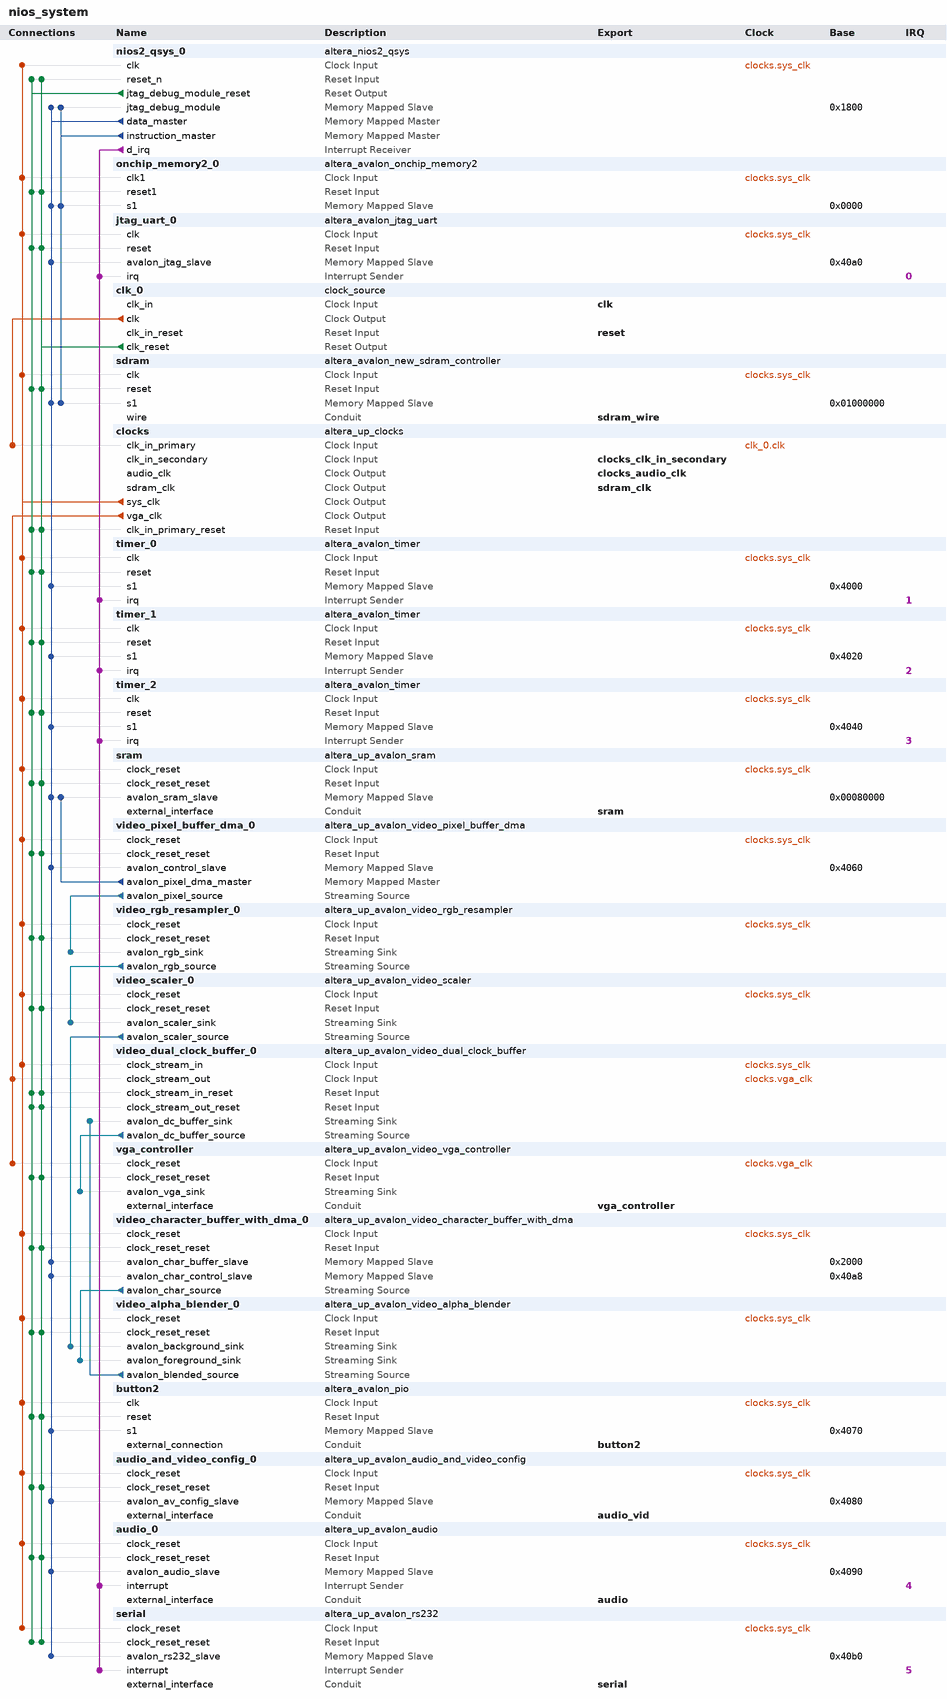
[diagram p0: system contents]
# Platform Designer (Qsys) system nios_system, Cyclone II EP2C35F672C6
# Parameters at their usual value, and those the tool derives, are not listed.
package require -exact qsys 12.0
create_system nios_system
set_project_property DEVICE_FAMILY {Cyclone II}
set_project_property DEVICE EP2C35F672C6

add_instance nios2_qsys_0 altera_nios2_qsys 12.0
set_instance_parameter_value nios2_qsys_0 resetSlave sdram.s1
set_instance_parameter_value nios2_qsys_0 exceptionSlave sdram.s1
set_instance_parameter_value nios2_qsys_0 breakSlave nios2_qsys_0.jtag_debug_module
set_instance_parameter_value nios2_qsys_0 impl Fast
set_instance_parameter_value nios2_qsys_0 icache_size 4096

add_instance onchip_memory2_0 altera_avalon_onchip_memory2 12.0
set_instance_parameter_value onchip_memory2_0 dataWidth 32
set_instance_parameter_value onchip_memory2_0 dualPort false
set_instance_parameter_value onchip_memory2_0 initMemContent true
set_instance_parameter_value onchip_memory2_0 initializationFileName onchip_memory2_0
set_instance_parameter_value onchip_memory2_0 memorySize 4096

add_instance jtag_uart_0 altera_avalon_jtag_uart 12.0
set_instance_parameter_value jtag_uart_0 simInteractiveOptions INTERACTIVE_ASCII_OUTPUT

add_instance clk_0 clock_source 12.0
set_instance_parameter_value clk_0 clockFrequency 50000000

add_instance sdram altera_avalon_new_sdram_controller 12.0
set_instance_parameter_value sdram TAC 5.5
set_instance_parameter_value sdram TRCD 20.0
set_instance_parameter_value sdram TRP 20.0
set_instance_parameter_value sdram casLatency 3
set_instance_parameter_value sdram columnWidth 8
set_instance_parameter_value sdram dataWidth 16
set_instance_parameter_value sdram generateSimulationModel false
set_instance_parameter_value sdram model custom
set_instance_parameter_value sdram numberOfBanks 4
set_instance_parameter_value sdram numberOfChipSelects 1
set_instance_parameter_value sdram powerUpDelay 100.0
set_instance_parameter_value sdram refreshPeriod 15.625
set_instance_parameter_value sdram rowWidth 12

add_instance clocks altera_up_clocks 12.0
set_instance_parameter_value clocks board DE2
set_instance_parameter_value clocks vga_clk true
set_instance_parameter_value clocks audio_clk true
set_instance_parameter_value clocks audio_clk_freq 12.288

add_instance timer_0 altera_avalon_timer 12.0
set_instance_parameter_value timer_0 period 1
set_instance_parameter_value timer_0 periodUnits MSEC
set_instance_parameter_value timer_0 timerPreset FULL_FEATURED

add_instance timer_1 altera_avalon_timer 12.0
set_instance_parameter_value timer_1 period 1
set_instance_parameter_value timer_1 periodUnits MSEC
set_instance_parameter_value timer_1 timerPreset CUSTOM

add_instance timer_2 altera_avalon_timer 12.0
set_instance_parameter_value timer_2 period 1
set_instance_parameter_value timer_2 periodUnits MSEC
set_instance_parameter_value timer_2 timerPreset CUSTOM

add_instance sram altera_up_avalon_sram 12.0
set_instance_parameter_value sram board DE2
set_instance_parameter_value sram pixel_buffer true

add_instance video_pixel_buffer_dma_0 altera_up_avalon_video_pixel_buffer_dma 12.0
set_instance_parameter_value video_pixel_buffer_dma_0 addr_mode X-Y
set_instance_parameter_value video_pixel_buffer_dma_0 start_address 0
set_instance_parameter_value video_pixel_buffer_dma_0 back_start_address 0
set_instance_parameter_value video_pixel_buffer_dma_0 image_width 320
set_instance_parameter_value video_pixel_buffer_dma_0 image_height 240
set_instance_parameter_value video_pixel_buffer_dma_0 color_space {16-bit RGB}

add_instance video_rgb_resampler_0 altera_up_avalon_video_rgb_resampler 12.0
set_instance_parameter_value video_rgb_resampler_0 input_type {16-bit RGB}
set_instance_parameter_value video_rgb_resampler_0 output_type {30-bit RGB}
set_instance_parameter_value video_rgb_resampler_0 alpha 1023

add_instance video_scaler_0 altera_up_avalon_video_scaler 12.0
set_instance_parameter_value video_scaler_0 width_scaling 2
set_instance_parameter_value video_scaler_0 height_scaling 2
set_instance_parameter_value video_scaler_0 width_in 320
set_instance_parameter_value video_scaler_0 color_bits 10
set_instance_parameter_value video_scaler_0 color_planes 3

add_instance video_dual_clock_buffer_0 altera_up_avalon_video_dual_clock_buffer 12.0
set_instance_parameter_value video_dual_clock_buffer_0 color_bits 10

add_instance vga_controller altera_up_avalon_video_vga_controller 12.0
set_instance_parameter_value vga_controller board DE2

add_instance video_character_buffer_with_dma_0 altera_up_avalon_video_character_buffer_with_dma 12.0
set_instance_parameter_value video_character_buffer_with_dma_0 enable_transparency true

add_instance video_alpha_blender_0 altera_up_avalon_video_alpha_blender 12.0

add_instance button2 altera_avalon_pio 12.0
set_instance_parameter_value button2 direction Input
set_instance_parameter_value button2 width 1

add_instance audio_and_video_config_0 altera_up_avalon_audio_and_video_config 12.0
set_instance_parameter_value audio_and_video_config_0 board DE2
set_instance_parameter_value audio_and_video_config_0 audio_in {Microphone to ADC}
set_instance_parameter_value audio_and_video_config_0 line_in_bypass false
set_instance_parameter_value audio_and_video_config_0 bit_length 16
set_instance_parameter_value audio_and_video_config_0 sampling_rate {32 kHz}

add_instance audio_0 altera_up_avalon_audio 12.0
set_instance_parameter_value audio_0 avalon_bus_type {Memory Mapped}
set_instance_parameter_value audio_0 audio_in true
set_instance_parameter_value audio_0 dw 16

add_instance serial altera_up_avalon_rs232 12.0
set_instance_parameter_value serial baud 115200
set_instance_parameter_value serial parity None

# connections
add_connection clk_0.clk clocks.clk_in_primary clock
add_connection clocks.sys_clk audio_0.clock_reset clock
add_connection clocks.sys_clk audio_and_video_config_0.clock_reset clock
add_connection clocks.sys_clk button2.clk clock
add_connection clocks.sys_clk jtag_uart_0.clk clock
add_connection clocks.sys_clk nios2_qsys_0.clk clock
add_connection clocks.sys_clk onchip_memory2_0.clk1 clock
add_connection clocks.sys_clk sdram.clk clock
add_connection clocks.sys_clk serial.clock_reset clock
add_connection clocks.sys_clk sram.clock_reset clock
add_connection clocks.sys_clk timer_0.clk clock
add_connection clocks.sys_clk timer_1.clk clock
add_connection clocks.sys_clk timer_2.clk clock
add_connection clocks.sys_clk video_alpha_blender_0.clock_reset clock
add_connection clocks.sys_clk video_character_buffer_with_dma_0.clock_reset clock
add_connection clocks.sys_clk video_dual_clock_buffer_0.clock_stream_in clock
add_connection clocks.sys_clk video_pixel_buffer_dma_0.clock_reset clock
add_connection clocks.sys_clk video_rgb_resampler_0.clock_reset clock
add_connection clocks.sys_clk video_scaler_0.clock_reset clock
add_connection clocks.vga_clk vga_controller.clock_reset clock
add_connection clocks.vga_clk video_dual_clock_buffer_0.clock_stream_out clock
add_connection clk_0.clk_reset audio_0.clock_reset_reset reset
add_connection clk_0.clk_reset audio_and_video_config_0.clock_reset_reset reset
add_connection clk_0.clk_reset button2.reset reset
add_connection clk_0.clk_reset clocks.clk_in_primary_reset reset
add_connection clk_0.clk_reset jtag_uart_0.reset reset
add_connection clk_0.clk_reset nios2_qsys_0.reset_n reset
add_connection clk_0.clk_reset onchip_memory2_0.reset1 reset
add_connection clk_0.clk_reset sdram.reset reset
add_connection clk_0.clk_reset serial.clock_reset_reset reset
add_connection clk_0.clk_reset sram.clock_reset_reset reset
add_connection clk_0.clk_reset timer_0.reset reset
add_connection clk_0.clk_reset timer_1.reset reset
add_connection clk_0.clk_reset timer_2.reset reset
add_connection clk_0.clk_reset vga_controller.clock_reset_reset reset
add_connection clk_0.clk_reset video_alpha_blender_0.clock_reset_reset reset
add_connection clk_0.clk_reset video_character_buffer_with_dma_0.clock_reset_reset reset
add_connection clk_0.clk_reset video_dual_clock_buffer_0.clock_stream_in_reset reset
add_connection clk_0.clk_reset video_dual_clock_buffer_0.clock_stream_out_reset reset
add_connection clk_0.clk_reset video_pixel_buffer_dma_0.clock_reset_reset reset
add_connection clk_0.clk_reset video_rgb_resampler_0.clock_reset_reset reset
add_connection clk_0.clk_reset video_scaler_0.clock_reset_reset reset
add_connection nios2_qsys_0.jtag_debug_module_reset audio_0.clock_reset_reset reset
add_connection nios2_qsys_0.jtag_debug_module_reset audio_and_video_config_0.clock_reset_reset reset
add_connection nios2_qsys_0.jtag_debug_module_reset button2.reset reset
add_connection nios2_qsys_0.jtag_debug_module_reset clocks.clk_in_primary_reset reset
add_connection nios2_qsys_0.jtag_debug_module_reset jtag_uart_0.reset reset
add_connection nios2_qsys_0.jtag_debug_module_reset nios2_qsys_0.reset_n reset
add_connection nios2_qsys_0.jtag_debug_module_reset onchip_memory2_0.reset1 reset
add_connection nios2_qsys_0.jtag_debug_module_reset sdram.reset reset
add_connection nios2_qsys_0.jtag_debug_module_reset serial.clock_reset_reset reset
add_connection nios2_qsys_0.jtag_debug_module_reset sram.clock_reset_reset reset
add_connection nios2_qsys_0.jtag_debug_module_reset timer_0.reset reset
add_connection nios2_qsys_0.jtag_debug_module_reset timer_1.reset reset
add_connection nios2_qsys_0.jtag_debug_module_reset timer_2.reset reset
add_connection nios2_qsys_0.jtag_debug_module_reset vga_controller.clock_reset_reset reset
add_connection nios2_qsys_0.jtag_debug_module_reset video_alpha_blender_0.clock_reset_reset reset
add_connection nios2_qsys_0.jtag_debug_module_reset video_character_buffer_with_dma_0.clock_reset_reset reset
add_connection nios2_qsys_0.jtag_debug_module_reset video_dual_clock_buffer_0.clock_stream_in_reset reset
add_connection nios2_qsys_0.jtag_debug_module_reset video_dual_clock_buffer_0.clock_stream_out_reset reset
add_connection nios2_qsys_0.jtag_debug_module_reset video_pixel_buffer_dma_0.clock_reset_reset reset
add_connection nios2_qsys_0.jtag_debug_module_reset video_rgb_resampler_0.clock_reset_reset reset
add_connection nios2_qsys_0.jtag_debug_module_reset video_scaler_0.clock_reset_reset reset
add_connection nios2_qsys_0.data_master audio_0.avalon_audio_slave avalon
set_connection_parameter_value nios2_qsys_0.data_master/audio_0.avalon_audio_slave baseAddress 0x4090
add_connection nios2_qsys_0.data_master audio_and_video_config_0.avalon_av_config_slave avalon
set_connection_parameter_value nios2_qsys_0.data_master/audio_and_video_config_0.avalon_av_config_slave baseAddress 0x4080
add_connection nios2_qsys_0.data_master button2.s1 avalon
set_connection_parameter_value nios2_qsys_0.data_master/button2.s1 baseAddress 0x4070
add_connection nios2_qsys_0.data_master jtag_uart_0.avalon_jtag_slave avalon
set_connection_parameter_value nios2_qsys_0.data_master/jtag_uart_0.avalon_jtag_slave baseAddress 0x40a0
add_connection nios2_qsys_0.data_master nios2_qsys_0.jtag_debug_module avalon
set_connection_parameter_value nios2_qsys_0.data_master/nios2_qsys_0.jtag_debug_module baseAddress 0x1800
add_connection nios2_qsys_0.data_master onchip_memory2_0.s1 avalon
set_connection_parameter_value nios2_qsys_0.data_master/onchip_memory2_0.s1 baseAddress 0x0000
add_connection nios2_qsys_0.data_master sdram.s1 avalon
set_connection_parameter_value nios2_qsys_0.data_master/sdram.s1 baseAddress 0x01000000
add_connection nios2_qsys_0.data_master serial.avalon_rs232_slave avalon
set_connection_parameter_value nios2_qsys_0.data_master/serial.avalon_rs232_slave baseAddress 0x40b0
add_connection nios2_qsys_0.data_master sram.avalon_sram_slave avalon
set_connection_parameter_value nios2_qsys_0.data_master/sram.avalon_sram_slave baseAddress 0x00080000
add_connection nios2_qsys_0.data_master timer_0.s1 avalon
set_connection_parameter_value nios2_qsys_0.data_master/timer_0.s1 baseAddress 0x4000
add_connection nios2_qsys_0.data_master timer_1.s1 avalon
set_connection_parameter_value nios2_qsys_0.data_master/timer_1.s1 baseAddress 0x4020
add_connection nios2_qsys_0.data_master timer_2.s1 avalon
set_connection_parameter_value nios2_qsys_0.data_master/timer_2.s1 baseAddress 0x4040
add_connection nios2_qsys_0.data_master video_character_buffer_with_dma_0.avalon_char_buffer_slave avalon
set_connection_parameter_value nios2_qsys_0.data_master/video_character_buffer_with_dma_0.avalon_char_buffer_slave baseAddress 0x2000
add_connection nios2_qsys_0.data_master video_character_buffer_with_dma_0.avalon_char_control_slave avalon
set_connection_parameter_value nios2_qsys_0.data_master/video_character_buffer_with_dma_0.avalon_char_control_slave baseAddress 0x40a8
add_connection nios2_qsys_0.data_master video_pixel_buffer_dma_0.avalon_control_slave avalon
set_connection_parameter_value nios2_qsys_0.data_master/video_pixel_buffer_dma_0.avalon_control_slave baseAddress 0x4060
add_connection nios2_qsys_0.instruction_master nios2_qsys_0.jtag_debug_module avalon
set_connection_parameter_value nios2_qsys_0.instruction_master/nios2_qsys_0.jtag_debug_module baseAddress 0x1800
add_connection nios2_qsys_0.instruction_master onchip_memory2_0.s1 avalon
set_connection_parameter_value nios2_qsys_0.instruction_master/onchip_memory2_0.s1 baseAddress 0x0000
add_connection nios2_qsys_0.instruction_master sdram.s1 avalon
set_connection_parameter_value nios2_qsys_0.instruction_master/sdram.s1 baseAddress 0x01000000
add_connection video_pixel_buffer_dma_0.avalon_pixel_dma_master sram.avalon_sram_slave avalon
set_connection_parameter_value video_pixel_buffer_dma_0.avalon_pixel_dma_master/sram.avalon_sram_slave baseAddress 0x00080000
add_connection video_alpha_blender_0.avalon_blended_source video_dual_clock_buffer_0.avalon_dc_buffer_sink avalon_streaming
add_connection video_character_buffer_with_dma_0.avalon_char_source video_alpha_blender_0.avalon_foreground_sink avalon_streaming
add_connection video_dual_clock_buffer_0.avalon_dc_buffer_source vga_controller.avalon_vga_sink avalon_streaming
add_connection video_pixel_buffer_dma_0.avalon_pixel_source video_rgb_resampler_0.avalon_rgb_sink avalon_streaming
add_connection video_rgb_resampler_0.avalon_rgb_source video_scaler_0.avalon_scaler_sink avalon_streaming
add_connection video_scaler_0.avalon_scaler_source video_alpha_blender_0.avalon_background_sink avalon_streaming
add_connection nios2_qsys_0.d_irq audio_0.interrupt interrupt
set_connection_parameter_value nios2_qsys_0.d_irq/audio_0.interrupt irqNumber 4
add_connection nios2_qsys_0.d_irq jtag_uart_0.irq interrupt
set_connection_parameter_value nios2_qsys_0.d_irq/jtag_uart_0.irq irqNumber 0
add_connection nios2_qsys_0.d_irq serial.interrupt interrupt
set_connection_parameter_value nios2_qsys_0.d_irq/serial.interrupt irqNumber 5
add_connection nios2_qsys_0.d_irq timer_0.irq interrupt
set_connection_parameter_value nios2_qsys_0.d_irq/timer_0.irq irqNumber 1
add_connection nios2_qsys_0.d_irq timer_1.irq interrupt
set_connection_parameter_value nios2_qsys_0.d_irq/timer_1.irq irqNumber 2
add_connection nios2_qsys_0.d_irq timer_2.irq interrupt
set_connection_parameter_value nios2_qsys_0.d_irq/timer_2.irq irqNumber 3

# exported interfaces
add_interface clk clock sink
set_interface_property clk EXPORT_OF clk_0.clk_in
add_interface reset reset sink
set_interface_property reset EXPORT_OF clk_0.clk_in_reset
add_interface sdram_wire conduit end
set_interface_property sdram_wire EXPORT_OF sdram.wire
add_interface sdram_clk clock source
set_interface_property sdram_clk EXPORT_OF clocks.sdram_clk
add_interface sram conduit end
set_interface_property sram EXPORT_OF sram.external_interface
add_interface vga_controller conduit end
set_interface_property vga_controller EXPORT_OF vga_controller.external_interface
add_interface button2 conduit end
set_interface_property button2 EXPORT_OF button2.external_connection
add_interface audio_vid conduit end
set_interface_property audio_vid EXPORT_OF audio_and_video_config_0.external_interface
add_interface audio conduit end
set_interface_property audio EXPORT_OF audio_0.external_interface
add_interface clocks_audio_clk clock source
set_interface_property clocks_audio_clk EXPORT_OF clocks.audio_clk
add_interface clocks_clk_in_secondary clock sink
set_interface_property clocks_clk_in_secondary EXPORT_OF clocks.clk_in_secondary
add_interface serial conduit end
set_interface_property serial EXPORT_OF serial.external_interface

save_system nios_system.qsys
